# EAGLE design CAN Tester rev2 (EAGLE 9.2.2)
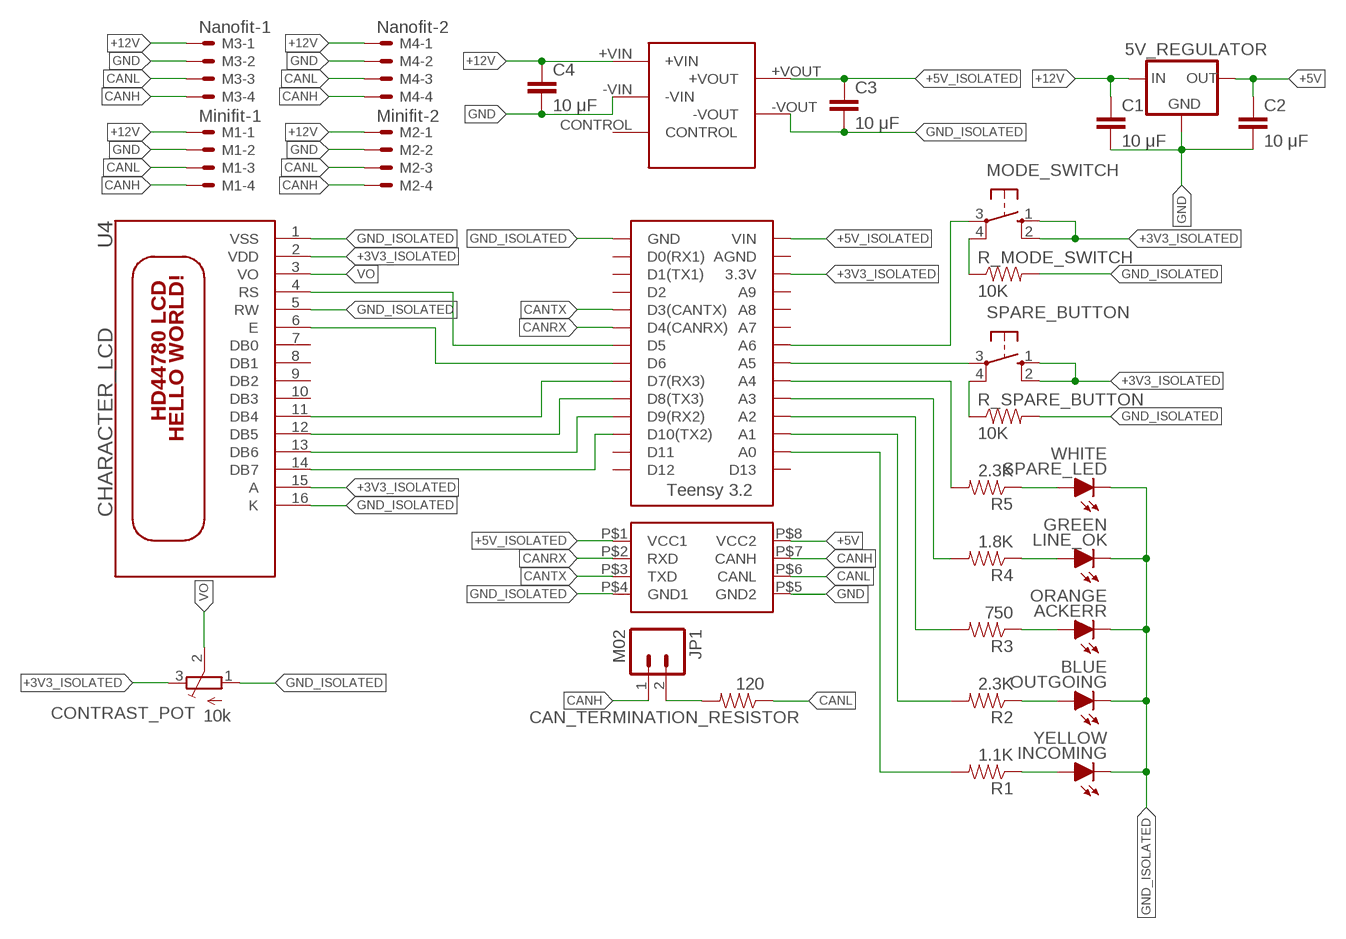
[diagram p0: schematic, sheet 1]

## Parts
5V_REGULATOR  5VREG_LM340-NLM340MPX-5.0/NOPB  [SOT223]
ACKERR  ORANGE  LED-0805  [LED-805]
C1  10 μF  CAP0805  [0805]
C2  10 μF  CAP0805  [0805]
C3  10 μF  CAP0805  [0805]
C4  10 μF  CAP0805  [0805]
CAN_TERMINATION_RESISTOR  120  RESISTOR0805-RES  [0805]
CONTRAST_POT  10k  TRIMPOT3386  [TRIM-3386]
INCOMING  YELLOW  LED-0805  [LED-805]
JP1  M02  [1X02]
LINE_OK  GREEN  LED-0805  [LED-805]
M1  Minifit-1  CONNECTOR-4  [MINIFIT_5566-4]
M2  Minifit-2  CONNECTOR-4  [MINIFIT_5566-4]
M3  Nanofit-1  CONNECTOR-4NANO-FIT-VERTICAL-4  [NANO-FIT_VERTICAL-4]
M4  Nanofit-2  CONNECTOR-4NANO-FIT-VERTICAL-4  [NANO-FIT_VERTICAL-4]
MODE_SWITCH  BTN_10-XX  [B3F-10XX]
OUTGOING  BLUE  LED-0805  [LED-805]
R1  1.1K  RESISTOR0805-RES  [0805]
R2  2.3K  RESISTOR0805-RES  [0805]
R3  750  RESISTOR0805-RES  [0805]
R4  1.8K  RESISTOR0805-RES  [0805]
R5  2.3K  RESISTOR0805-RES  [0805]
R_MODE_SWITCH  10K  RESISTOR0805-RES  [0805]
R_SPARE_BUTTON  10K  RESISTOR0805-RES  [0805]
SPARE_BUTTON  BTN_10-XX  [B3F-10XX]
SPARE_LED  WHITE  LED-0805  [LED-805]
U1  ISOCAN  ISO1050CAN  [DUB8]
U3  TEENSY_3.2_SIMPLE  [TEENSY_3.2_SIMPLE]
U4  CHARACTER_LCD  HD44780LCD-1602  [LCD1602]
U$1  NCS1S1205SC-12V-5VCONVERTER  [DCDC-CONVERTER]

## Nets
+3V3_ISOLATED: CONTRAST_POT.3(E) MODE_SWITCH.1(S) MODE_SWITCH.2(S1) SPARE_BUTTON.1(S) SPARE_BUTTON.2(S1) U3.3.3V U4.2(VDD) U4.15(A)
+5V: 5V_REGULATOR.3(OUT) C2.1 U1.P$8(VCC2)
+5V_ISOLATED: C3.1 U1.P$1(VCC1) U3.VIN U$1.+VOUT
+12V: 5V_REGULATOR.1(IN) C1.1 C4.1 M1.1 M2.1 M3.P$1 M4.P$1 U$1.+VIN
CANH: JP1.1 M1.4 M2.4 M3.P$4 M4.P$4 U1.P$7(CANH)
CANL: CAN_TERMINATION_RESISTOR.1 M1.3 M2.3 M3.P$3 M4.P$3 U1.P$6(CANL)
CANRX: U1.P$2(RXD) U3.D4(CANRX)
CANTX: U1.P$3(TXD) U3.D3(CANTX)
GND: 5V_REGULATOR.2(GND) 5V_REGULATOR.4(GND) C1.2 C2.2 C4.2 M1.2 M2.2 M3.P$2 M4.P$2 U1.P$5(GND2) U$1.-VIN
GND_ISOLATED: ACKERR.C C3.2 CONTRAST_POT.1(A) INCOMING.C LINE_OK.C OUTGOING.C R_MODE_SWITCH.2 R_SPARE_BUTTON.2 SPARE_LED.C U1.P$4(GND1) U3.GND U4.1(VSS) U4.5(RW) U4.16(K) U$1.-VOUT
N$1: R1.2 U3.A0
N$2: R5.1 SPARE_LED.A
N$3: SPARE_BUTTON.3(P) U3.A5
N$4: R2.2 U3.A1
N$5: R3.2 U3.A2
N$6: R4.2 U3.A3
N$7: R5.2 U3.A4
N$8: LINE_OK.A R4.1
N$9: ACKERR.A R3.1
N$10: OUTGOING.A R2.1
N$11: INCOMING.A R1.1
N$12: MODE_SWITCH.4(P1) R_MODE_SWITCH.1
N$13: MODE_SWITCH.3(P) U3.A6
N$14: R_SPARE_BUTTON.1 SPARE_BUTTON.4(P1)
N$15: CAN_TERMINATION_RESISTOR.2 JP1.2
N$17: U3.D5 U4.4(RS)
N$18: U3.D6 U4.6(E)
N$19: U3.D7(RX3) U4.11(DB4)
N$20: U3.D8(TX3) U4.12(DB5)
N$21: U3.D9(RX2) U4.13(DB6)
N$22: U3.D10(TX2) U4.14(DB7)
VO: CONTRAST_POT.2(S) U4.3(VO)
Unconnected: U3.A7 U3.A8 U3.A9 U3.AGND U3.D0(RX1) U3.D1(TX1) U3.D2 U3.D11 U3.D12 U3.D13 U4.7(DB0) U4.8(DB1) U4.9(DB2) U4.10(DB3) U$1.CONTROL

## Library data of the parts
5V_REGULATOR = HyTechDevices:5VREG_LM340-N: Voltage Regulator 5v linear voltage regulator Datasheet <http://www.mouser.com/ProductDetail/Texas-Instruments/LM340MPX-50-NOPB/?qs=X1J7HmVL2ZGZwtTFRQ9ItA%3D%3D> MAX current out: 1.5A MAX voltage in: 35V
ACKERR INCOMING LINE_OK OUTGOING SPARE_LED = HyTechDevices:LED: Light Emitting Diode (LED) Source: Dangerous Prototypes Eagle Library <https://github.com/DangerousPrototypes/Eagle_Part_Library>
C1-C4 = HyTechDevices:CAP: Capacitor Standard 0603 ceramic capacitor, and 0.1" leaded capacitor.
CAN_TERMINATION_RESISTOR R1-R5 R_MODE_SWITCH R_SPARE_BUTTON = HyTechDevices:RESISTOR: Resistor Basic schematic elements and footprints for 0603, 1206, and PTH resistors.
CONTRAST_POT = HyTechDevices:TRIMPOT: SMT trimmer potentiometer part number TC33X http://www.ladyada.net/library/eagle
JP1 = HyTechDevices:M02: Standard 2-pin 0.1" header. NOTES ON THE VARIANTS LOCK and LOCK_LONGPADS... This footprint was designed to help hold the alignment of a through-hole component (i.e. 6-pin header) while soldering it into place. You may notice that each hole has been shifted either up or down by 0.005 of an inch from it's more standard position (which is a perfectly straight line). This slight alteration caused the pins (the squares in the middle) to touch the edges of the holes. Because they are alternating, it causes a "brace" to hold the component in place. 0.005 has proven to be the perfect amount of "off-center" position when using our standard breakaway headers. Although looks a little odd when you look at the bare footprint, once you have a header in there, the alteration is very hard to notice. Also,if you push a header all the way into place, it is covered up entirely on the bottom side. This idea of altering the position of holes to aid alignment will be further integrated into the Sparkfun Library for other footprints. It can help hold any component with 3 or more connection pins. Note: The Sparkfun version includes many other packages including surface mount that may be of future interest. Source: Sparkfun <https://github.com/sparkfun/SparkFun-Eagle-Libraries>
M1 M2 = HyTechDevices:CONNECTOR-4: Mini-Fit Junior connector 4 pole Source: http://www.molex.com; OC_FARNELL: unknown; OC_NEWARK: unknown
M3 M4 = HyTechDevices:CONNECTOR-4: Mini-Fit Junior connector 4 pole Source: http://www.molex.com
MODE_SWITCH SPARE_BUTTON = HyTechDevices:BTN_10-XX: Small momentary tactile push button; MPN: B3F-1000; OC_FARNELL: 176432; OC_NEWARK: 36M3542
U1 = HyTechDevices:ISO1050CAN
U3 = HyTechDevices:TEENSY_3.2_SIMPLE: Simple version of the Teensy 3.2 board that only uses the 2 main rows of pins, not the inner pins or the pins opposite the usb port.
U4 = HyTechDevices:HD44780LCD: HD44780 LCD Standard character type LCDs, available in sizes from 8x1 to 40x4!
U$1 = HyTechDevices:NCS1S1205SC-12V-5VCONVERTER

## Net classes
0 default: width 0.406 mm, clearance 0.406 mm

## Board
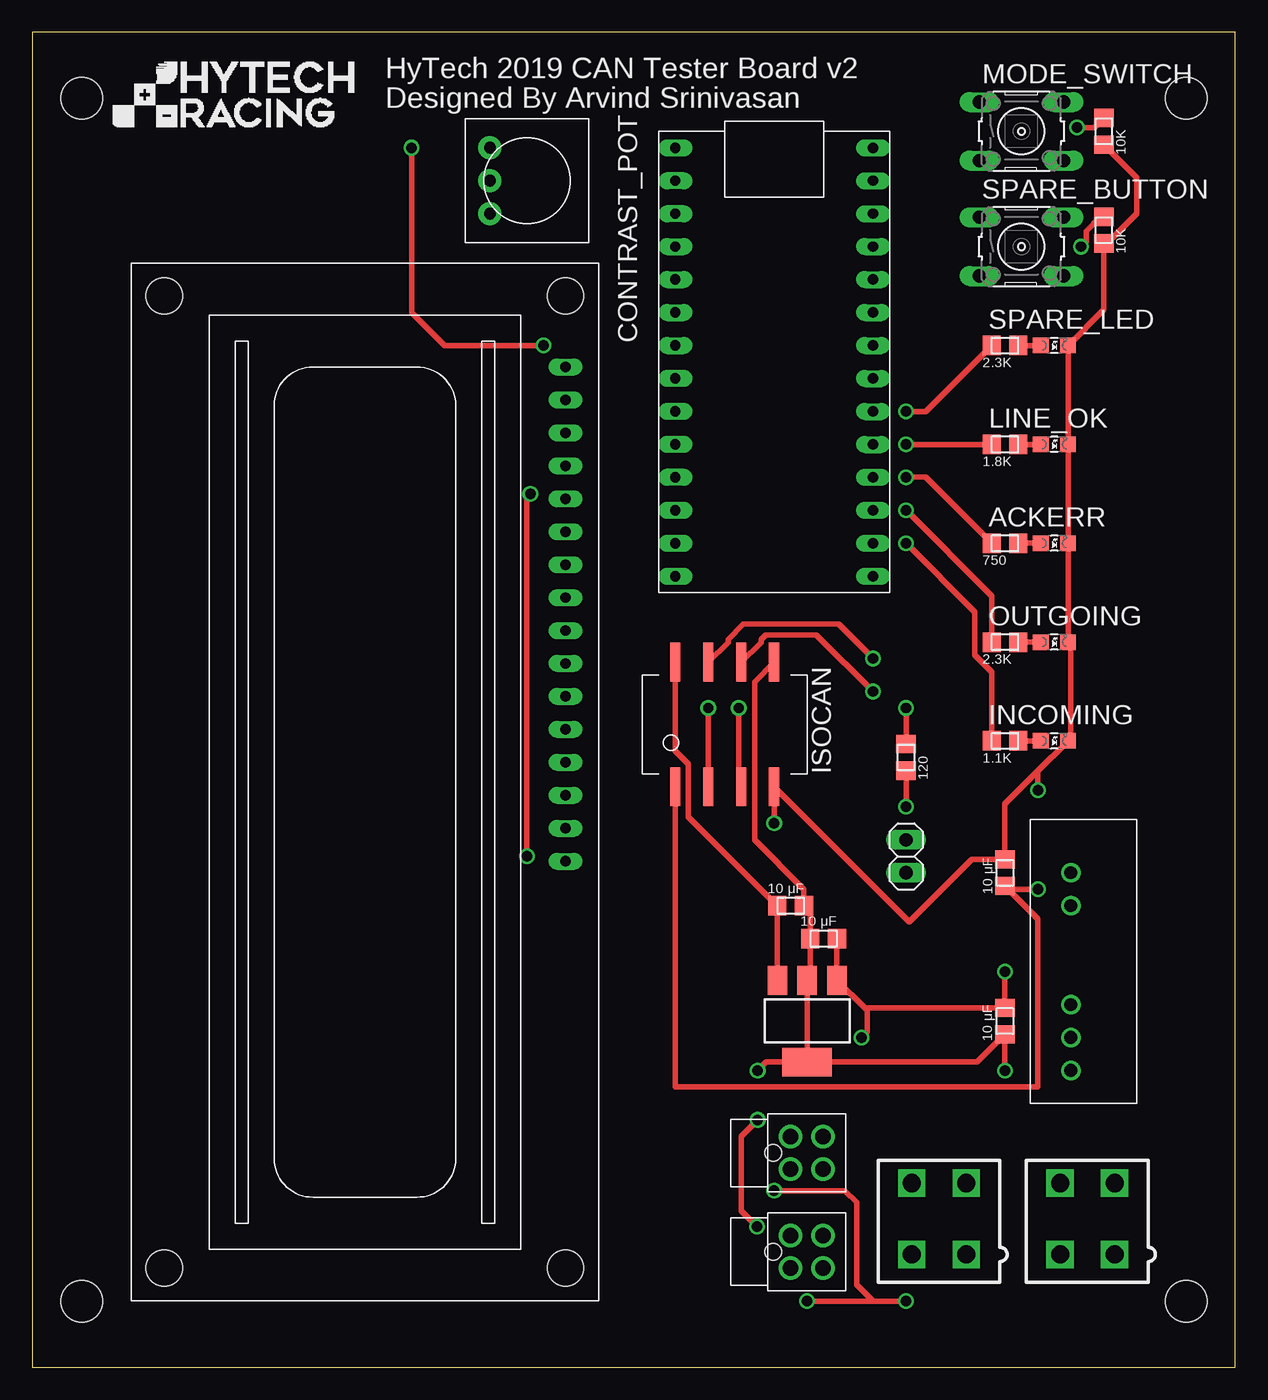
[diagram p1: board, top side]
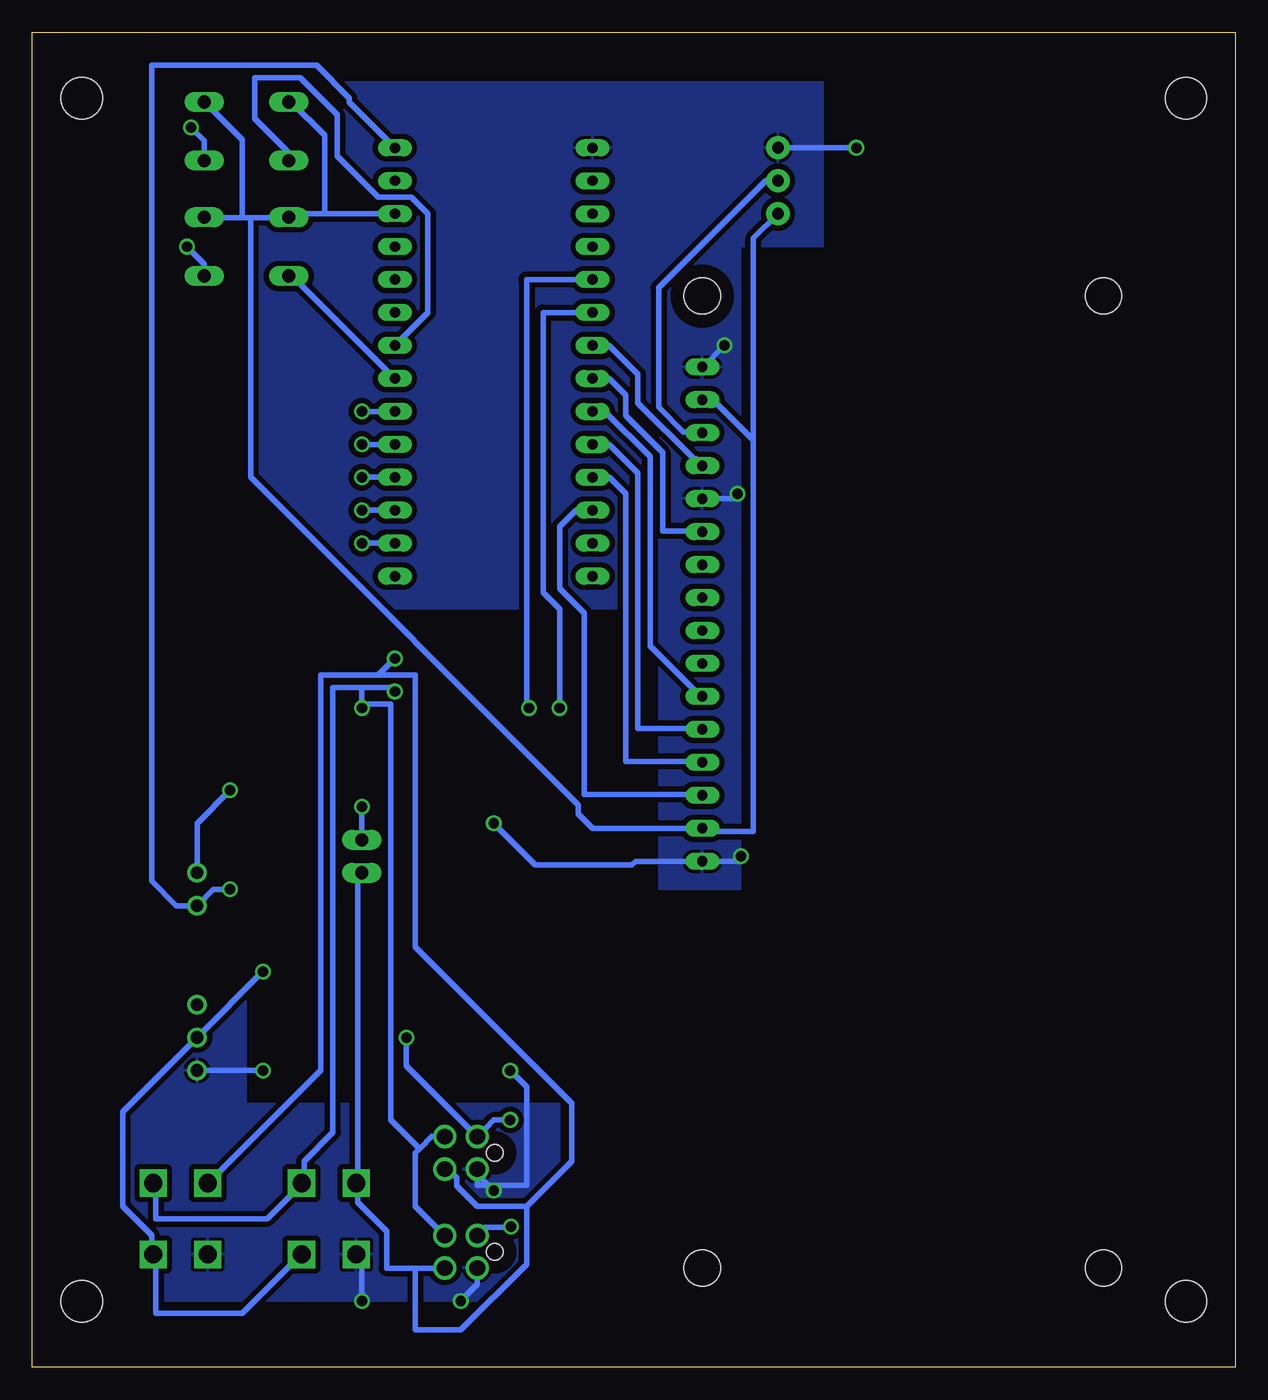
[diagram p2: board, bottom side, seen from below]

Size 92.69 x 102.87 mm. Coordinates in mm from the lower left corner, seen from the top.
Outline: 0,0 92.69,0 92.69,102.87 0,102.87 0,0
Copper layers (1*16): Top 0.035mm / dielectric 1.5mm / Bottom 0.035mm
Design rules "DRC Advanced Circuits": minimum track width 6mil, minimum drill 15mil, track to track 6mil, track to pad 6mil, pad to pad 6mil, via to via 6mil, smd to smd 6mil, copper to edge 40mil, drill to drill 6mil, minimum pad ring 10mil, minimum via ring 8mil, stop-mask expansion 4mil, vias tented up to drill 0mil, thermal gap 10mil
Holes 3.2 mm at 3.81,97.79 88.9,97.79 88.9,5.08 3.81,5.08

### Footprints (pad centres in the part's own frame; a part is rotated, then mirrored left to right if it is on the bottom)
SOT223 = smd 1.5 x 2.235: 1 -2.3,-3.15; 2 0,-3.15; 3 2.3,-3.15 | smd 3.8 x 2.2: 4 0,3.15
LED-805 = smd 1.2 x 1.2: A 0,-1.05; C 0,1.05
0805 = smd 1.4 x 1.5: 1 -1.025,0; 2 1.025,0
TRIM-3386 = drill 0.9 pad 1.778: 1 -2.54,-2.857; 2 0,-2.857; 3 2.54,-2.857
1X02 = drill 1.016 long: 1 -1.27,0; 2 1.27,0
MINIFIT_5566-4 = drill 1.4 square: 1 2.1,-2.75; 2 -2.1,-2.75; 3 2.1,2.75; 4 -2.1,2.75
NANO-FIT_VERTICAL-4 = drill 1.2: P$1 -1.25,0; P$2 1.25,0; P$3 -1.25,2.5; P$4 1.25,2.5 | hole 1.3: 0,-1.34
B3F-10XX = drill 1.016 long: 1 -3.251,2.261; 2 3.251,2.261; 3 -3.251,-2.261; 4 3.251,-2.261
DUB8 = smd 0.8 x 3: P$1 -3.81,-4.8; P$2 -1.27,-4.8; P$3 1.27,-4.8; P$4 3.81,-4.8; P$5 3.81,4.8; P$6 1.27,4.8; P$7 -1.27,4.8; P$8 -3.81,4.8
TEENSY_3.2_SIMPLE = drill 0.8 long: 3.3V 16.51,29.21; A0 16.51,3.81; A1 16.51,6.35; A2 16.51,8.89; A3 16.51,11.43; A4 16.51,13.97; A5 16.51,16.51; A6 16.51,19.05; A7 16.51,21.59; A8 16.51,24.13; A9 16.51,26.67; AGND 16.51,31.75; D0(RX1) 1.27,31.75; D1(TX1) 1.27,29.21; D2 1.27,26.67; D3(CANTX) 1.27,24.13; D4(CANRX) 1.27,21.59; D5 1.27,19.05; D6 1.27,16.51; D7(RX3) 1.27,13.97; D8(TX3) 1.27,11.43; D9(RX2) 1.27,8.89; D10(TX2) 1.27,6.35; D11 1.27,3.81; D12 1.27,1.27; D13 16.51,1.27; GND 1.27,34.29; VIN 16.51,34.29
LCD1602 = drill 0.8 long: 1 8,33.46; 2 10.54,33.46; 3 13.08,33.46; 4 15.62,33.46; 5 18.16,33.46; 6 20.7,33.46; 7 23.24,33.46; 8 25.78,33.46; 9 28.32,33.46; 10 30.86,33.46; 11 33.4,33.46; 12 35.94,33.46; 13 38.48,33.46; 14 41.02,33.46; 15 43.56,33.46; 16 46.1,33.46 | hole 2.8: 2.54,2.54; 2.54,33.46; 77.46,33.46; 77.46,2.54
DCDC-CONVERTER = drill 0.991: +VIN -6.35,0; +VOUT 3.81,0; -VIN -8.89,0; -VOUT 6.35,0; CONTROL -3.81,0

### Placement (x,y rotation side)
5V_REGULATOR  59.69,26.67 180 top
ACKERR  78.74,63.5 270 top
C1  60.96,33.02 180 top
C2  58.42,35.56 0 top
C3  74.93,38.1 90 top
C4  74.93,26.67 270 top
CAN_TERMINATION_RESISTOR  67.31,46.99 270 top
CONTRAST_POT  38.1,91.44 270 top
INCOMING  78.74,48.26 270 top
JP1  67.31,39.37 90 top
LINE_OK  78.74,71.12 270 top
M1  69.85,11.43 0 top
M2  81.28,11.43 0 top
M3  58.42,8.89 270 top
M4  58.42,16.51 270 top
MODE_SWITCH  76.2,95.25 0 top
OUTGOING  78.74,55.88 270 top
R1  74.93,48.26 180 top
R2  74.93,55.88 180 top
R3  74.93,63.5 180 top
R4  74.93,71.12 180 top
R5  74.93,78.74 180 top
R_MODE_SWITCH  82.55,95.25 270 top
R_SPARE_BUTTON  82.55,87.63 270 top
SPARE_BUTTON  76.2,86.36 0 top
SPARE_LED  78.74,78.74 270 top
U1  53.34,49.53 0 top
U3  48.26,59.69 0 top
U4  7.62,85.09 270 top
U$1  80.01,31.75 90 top

### Tracks (layer width: path | path; a pad name or v marks a point on that pad's centre or on a via)
+3V3_ISOLATED
  Bottom 0.406: 70.17,88.9 72.71,88.9 72.95,88.66 SPARE_BUTTON.1 73.62,88.62 73.66,88.58 75.88,88.58 | 70.17,88.9 U3.3.3V | 75.88,88.58 76.52,88.58 | 70.17,88.9 70.17,94.93 72.75,97.51 MODE_SWITCH.1 | 76.52,88.58 76.52,94.61 79.41,97.51 MODE_SWITCH.2 | 37.15,71.44 37.15,41.27 40.96,41.27 40.96,41.41 U4.15 49.53,41.53 50.64,42.64 50.64,43.34 75.88,68.58 75.88,88.58 | 37.15,71.44 40.01,74.3 40.96,74.3 41.08,74.42 U4.2 | CONTRAST_POT.3 37.15,87 37.15,71.44 | SPARE_BUTTON.2 79.41,88.58 76.52,88.58
+5V
  Top 0.406: 5V_REGULATOR.3 C2.1 50.54,42.41 50.54,46.48 49.53,47.49 U1.P$8
+5V_ISOLATED  (via drill 0.8 pad 0.8)
  Top 0.406: U1.P$1 49.53,21.59 77.47,21.59 77.47,34.53 C3.1 75.17,36.83 v77.47,36.83
  Bottom 0.406: U3.VIN 68.26,97.47 68.26,97.79 70.8,100.33 83.5,100.33 83.5,37.47 81.6,35.56 U$1.+VOUT 78.74,36.83 v77.47,36.83
+12V  (via drill 0.8 pad 0.8)
  Top 0.406: 64.11,27.7 5V_REGULATOR.1 C1.1 | 64.11,27.7 C4.1 v74.93,30.48 | v63.88,25.4 64.32,25.84 64.32,27.49 64.11,27.7 | v55.88,19.05 54.61,17.78 54.61,12.05 v55.82,10.84
  Bottom 0.406: v63.88,25.4 63.88,23.21 58.45,17.79 | v74.93,30.48 U$1.+VIN 85.72,19.68 85.72,12.38 83.5,10.16 83.5,8.8 M2.1 83.27,8.57 83.19,8.57 83.19,4.13 76.52,4.13 71.97,8.68 M1.1 | v55.88,19.05 57.13,19.05 57.8,18.38 57.85,18.38 58.45,17.79 | v55.82,10.84 55.91,10.76 57.85,10.76 58.45,10.17 M3.P$1 | M4.P$1 58.45,17.79
CANH  (via drill 0.8 pad 0.8)
  Top 0.406: U1.P$7 53.6,55.86 53.6,56.08 54.77,57.25 62.13,57.25 v64.77,54.61
  Bottom 0.406: JP1.1 67.63,37.78 67.63,14.29 67.73,14.18 M1.4 67.75,14.09 67.63,13.97 67.63,12.7 65.41,10.48 65.41,7.62 63.18,7.62 | 63.18,7.62 60.96,7.62 60.94,7.64 M3.P$4 | 54.61,12.38 58.42,12.38 60.01,13.97 60.01,14.61 60.66,15.26 M4.P$4 | 54.61,12.38 54.61,7.94 59.69,2.86 63.18,2.86 63.18,7.62 | 66.04,53.34 63.18,53.34 63.18,32.38 51.12,20.32 51.12,15.88 54.61,12.38 | 66.04,53.34 70.48,53.34 70.48,22.86 79.17,14.18 M2.4 | 66.04,53.34 v64.77,54.61
CANL  (via drill 0.8 pad 0.8)
  Top 0.406: CAN_TERMINATION_RESISTOR.1 v67.31,50.8 | v64.77,52.07 60.4,56.44 56.5,56.44 56.14,56.08 56.14,55.86 U1.P$6
  Bottom 0.406: 62.87,16.83 61.91,17.78 60.96,17.78 60.94,17.76 M4.P$3 | 62.87,16.83 63.18,16.51 63.18,12.38 60.96,10.16 60.94,10.16 M3.P$3 | 62.87,16.83 65.09,19.05 65.09,51.12 67.31,51.12 | 67.31,52.39 69.53,52.39 69.53,18.1 71.75,15.88 71.75,14.38 M1.3 72.07,14.06 72.07,13.97 74.61,11.43 83.19,11.43 83.19,13.97 83.38,14.16 M2.3 | v67.31,50.8 67.31,51.12 | 67.31,51.12 67.31,52.39 | 67.31,52.39 65.09,52.39 v64.77,52.07
CANRX  (via drill 0.8 pad 0.8)
  Top 0.406: U1.P$2 v52.07,50.8
  Bottom 0.406: v52.07,50.8 52.07,58.42 53.34,59.69 53.34,81.28 U3.D4(CANRX)
CANTX  (via drill 0.8 pad 0.8)
  Top 0.406: v54.42,50.8 54.42,44.92 U1.P$3
  Bottom 0.406: v54.42,50.8 54.61,50.99 54.61,83.82 U3.D3(CANTX)
GND  (via drill 0.8 pad 0.8)
  Top 0.406: 5V_REGULATOR.4 72.81,23.52 C4.2 v74.93,22.86 | U1.P$5 55.63,52.81 55.63,40.64 59.45,36.83 C2.2 59.94,35.07 C1.2 59.94,30.07 5V_REGULATOR.2 5V_REGULATOR.4 | v59.69,5.08 64.77,5.08 | 64.77,5.08 v67.31,5.08 | v55.88,22.86 56.54,23.52 5V_REGULATOR.4 | 64.77,5.08 63.5,6.35 63.5,12.7 62.6,13.6 v57.15,13.6
  Bottom 0.406: M3.P$2 58.42,6.37 59.69,5.1 v59.69,5.08 | v67.31,5.08 67.31,8.24 M1.2 | 58.42,14.87 58.42,13.99 54.61,13.99 54.61,21.59 v55.88,22.86 | v74.93,22.86 U$1.-VIN | v57.15,13.6 58.42,14.87 | 58.42,14.87 M4.P$2
  pour Bottom: 52.07,5.08 87.63,5.08 87.63,44.45 76.2,44.45 76.2,20.32 52.07,20.32
GND_ISOLATED  (via drill 0.8 pad 0.8)
  Top 0.406: 82.55,86.36 82.55,81.5 SPARE_LED.C LINE_OK.C ACKERR.C OUTGOING.C 80.01,55.88 80.01,48.48 INCOMING.C 77.36,45.83 | 82.55,86.36 R_SPARE_BUTTON.2 | R_MODE_SWITCH.2 85.09,91.69 85.09,88.88 83.55,87.34 83.53,87.34 82.55,86.36 | 77.36,45.83 74.93,43.4 C3.2 72.39,39.12 67.57,34.31 U1.P$4 v57.15,41.91 | v29.21,93.98 29.21,81.28 31.75,78.74 v39.37,78.74 | v77.47,44.45 77.47,45.72 77.36,45.83 | v38.1,39.37 38.1,67.05 v38.36,67.31
  Bottom 0.406: U$1.-VOUT 80.01,41.91 v77.47,44.45 | v39.37,78.74 41.02,77.09 U4.1 | CONTRAST_POT.1 v29.21,93.98 | v57.15,41.91 53.96,38.72 46.49,38.72 46.22,38.99 U4.16 38.48,38.99 v38.1,39.37 | v38.36,67.31 38.74,66.93 U4.5
  pour Bottom: 31.75,99.06 31.75,86.36 38.1,86.36 38.1,36.83 44.45,36.83 44.45,58.42 82.55,58.42 82.55,99.06
N$1  (via drill 0.8 pad 0.8)
  Top 0.406: R1.2 73.91,53.57 72.59,54.88 72.59,58.22 v67.31,63.5
  Bottom 0.406: U3.A0 v67.31,63.5
N$2
  Top 0.406: R5.1 SPARE_LED.A
N$3
  Bottom 0.406: U3.A5 72.71,84.14 72.75,84.1 SPARE_BUTTON.3
N$4  (via drill 0.8 pad 0.8)
  Top 0.406: v67.31,66.04 73.91,59.45 R2.2
  Bottom 0.406: U3.A1 v67.31,66.04
N$5  (via drill 0.8 pad 0.8)
  Top 0.406: v67.31,68.58 68.83,68.58 R3.2
  Bottom 0.406: U3.A2 v67.31,68.58
N$6  (via drill 0.8 pad 0.8)
  Top 0.406: v67.31,71.12 R4.2
  Bottom 0.406: U3.A3 v67.31,71.12
N$7  (via drill 0.8 pad 0.8)
  Top 0.406: v67.31,73.66 68.83,73.66 R5.2
  Bottom 0.406: U3.A4 v67.31,73.66
N$8
  Top 0.406: LINE_OK.A R4.1
N$9
  Top 0.406: ACKERR.A R3.1
N$10
  Top 0.406: OUTGOING.A R2.1
N$11
  Top 0.406: INCOMING.A R1.1
N$12  (via drill 0.8 pad 0.8)
  Top 0.406: v80.48,95.54 81.82,95.54 R_MODE_SWITCH.1
  Bottom 0.406: MODE_SWITCH.4 79.45,94.51 v80.48,95.54
N$13
  Bottom 0.406: U3.A6 62.23,81.28 62.23,88.9 63.5,90.17 66.04,90.17 69.22,93.34 69.22,96.52 72.07,99.38 75.56,99.38 75.56,96.2 73.03,93.66 73.03,93.07 MODE_SWITCH.3
N$14  (via drill 0.8 pad 0.8)
  Top 0.406: R_SPARE_BUTTON.1 82.29,88.66 81.19,87.56 81.19,86.76 v80.79,86.36
  Bottom 0.406: SPARE_BUTTON.4 79.45,85.02 v80.79,86.36
N$15  (via drill 0.8 pad 0.8)
  Top 0.406: CAN_TERMINATION_RESISTOR.2 v67.31,43.18
  Bottom 0.406: v67.31,43.18 JP1.2
N$17
  Bottom 0.406: U3.D5 48.26,78.74 46.04,76.52 46.04,74.3 41.75,70.01 41.62,70.01 U4.4
N$18
  Bottom 0.406: U3.D6 48.26,76.2 46.99,74.93 46.99,73.34 44.13,70.48 44.13,64.45 41.27,64.45 41.21,64.39 U4.6
N$19
  Bottom 0.406: U3.D7(RX3) 48.58,73.66 45.09,70.17 45.09,55.56 41.21,51.69 U4.11
N$20
  Bottom 0.406: U3.D8(TX3) 48.26,71.12 46.04,68.9 46.04,49.21 41.14,49.21 U4.12
N$21
  Bottom 0.406: U3.D9(RX2) 48.26,68.58 46.99,67.31 46.99,46.67 41.14,46.67 U4.13
N$22
  Bottom 0.406: U3.D10(TX2) 50.8,66.04 52.07,64.77 52.07,60.01 50.16,58.1 50.16,44.13 41.14,44.13 U4.14
VO
  Bottom 0.406: CONTRAST_POT.2 36.2,91.44 44.45,83.19 44.45,73.98 42.55,72.07 41.14,72.07 U4.3

### Text on the board
tNames: HyTech 2019 CAN Tester Board v2 | Designed By Arvind Srinivasan